# EAGLE schematic Drinks_MotorDriver (EAGLE 6.4)
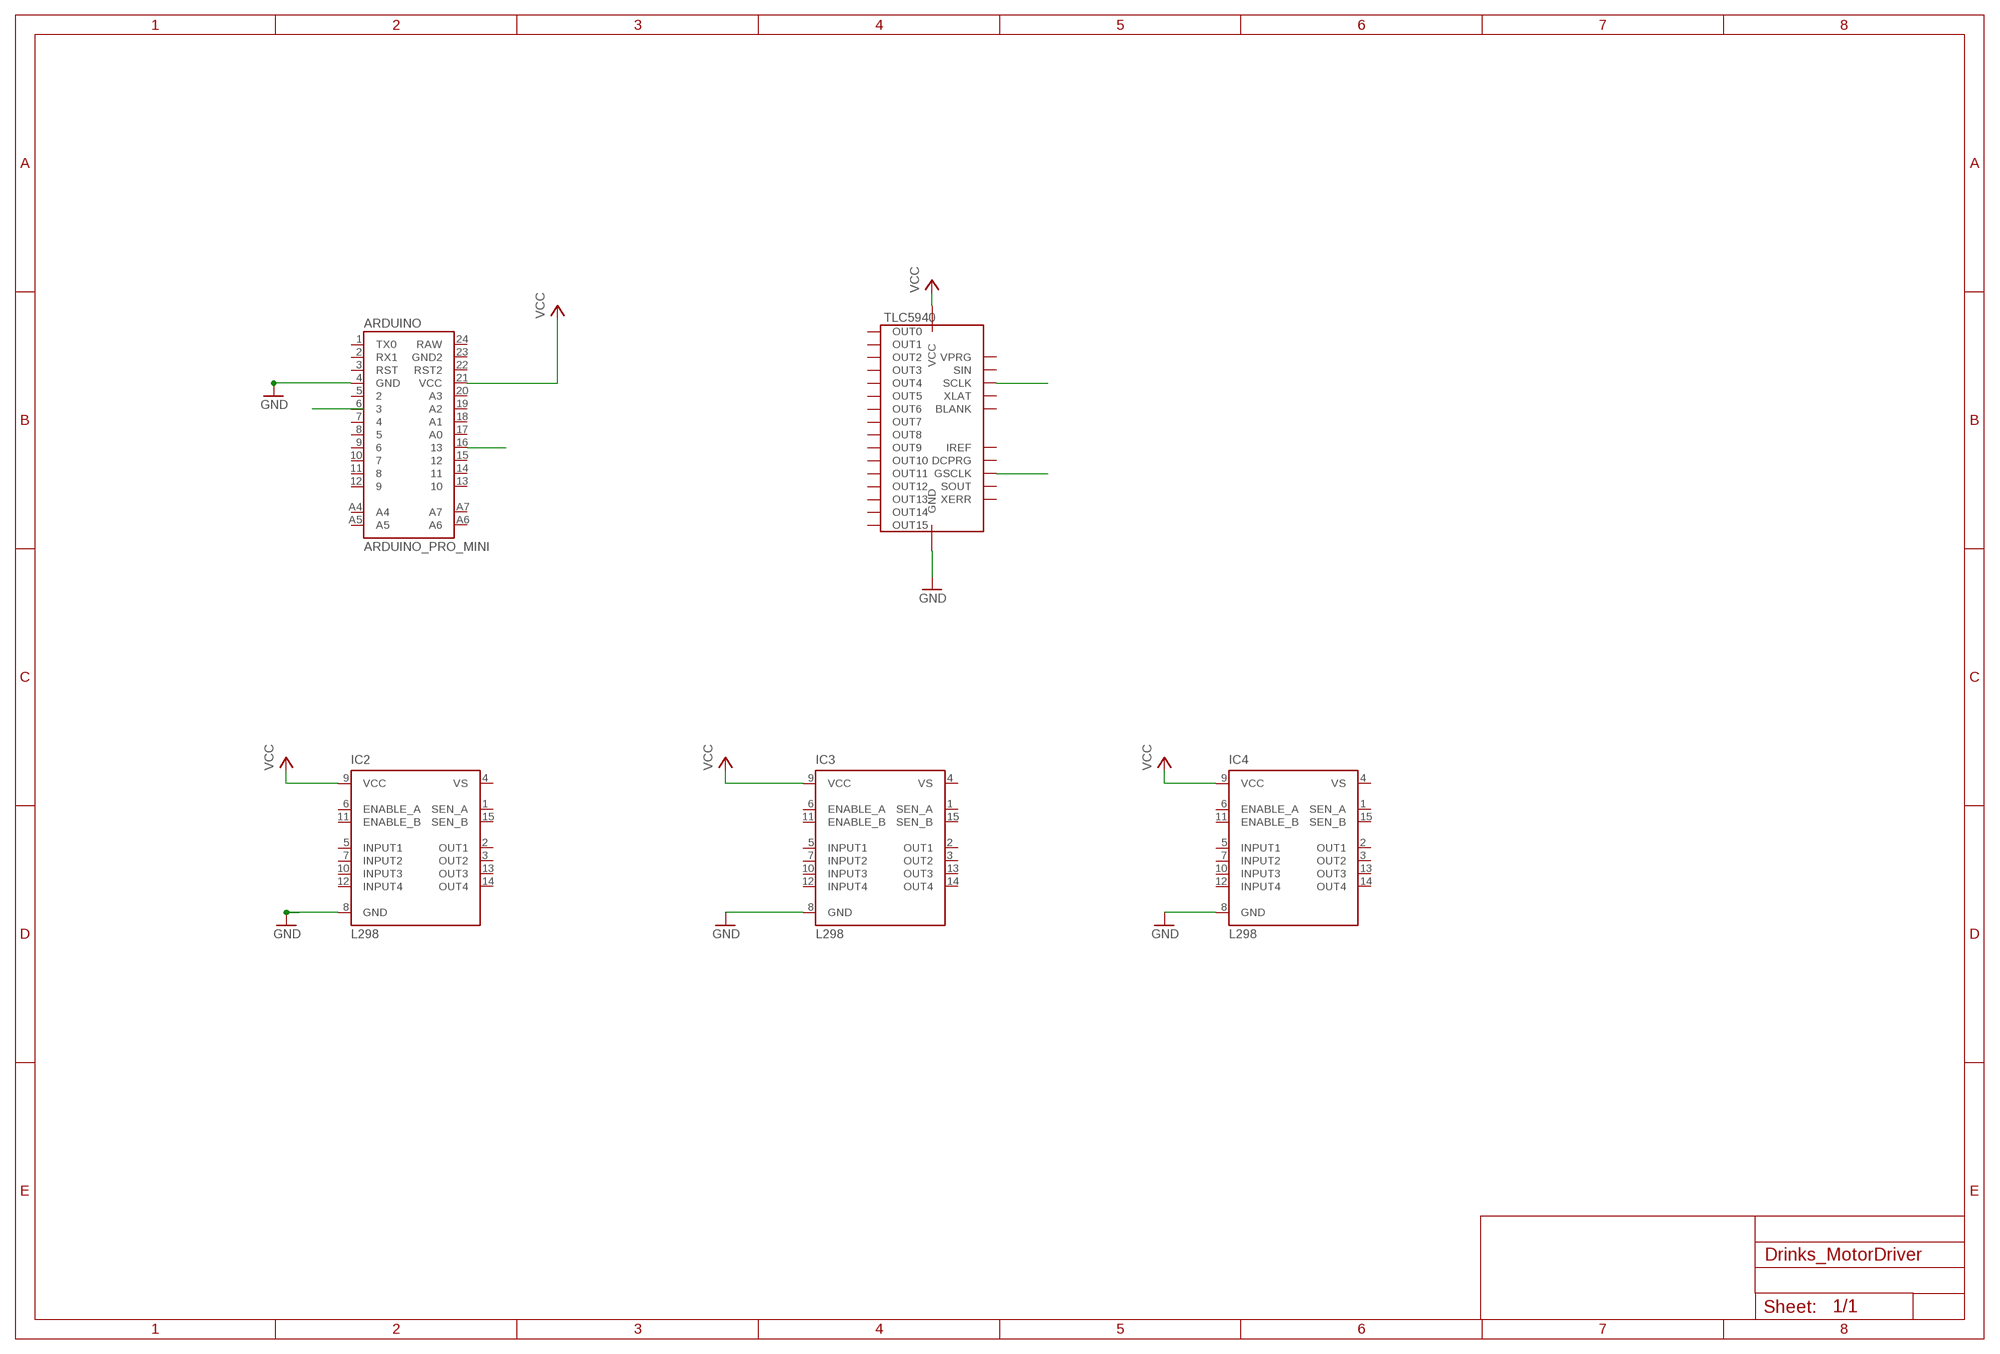
[diagram p0: schematic, sheet 1]

## Parts
ARDUINO  ARDUINO_PRO_MINI  [ARDUINO_PRO_MINI]
IC2  L298  [MULTIWATT-15]
IC3  L298  [MULTIWATT-15]
IC4  L298  [MULTIWATT-15]
TLC5940  IC-PACKAGE_DIL28-4  [IC-PACKAGE_DIL28-4]

## Nets
GND: ARDUINO.4(GND) IC2.8(GND) IC3.8(GND) IC4.8(GND) TLC5940.22(GND)
GSCLK: TLC5940.18(GSCLK)
SCLK: ARDUINO.16 TLC5940.25(SCLK)
VCC: ARDUINO.21(VCC) IC2.9(VCC) IC3.9(VCC) IC4.9(VCC) TLC5940.21(VCC)
Unconnected: ARDUINO.1(TX0) ARDUINO.2(RX1) ARDUINO.3(RST) ARDUINO.5 ARDUINO.6 ARDUINO.7 ARDUINO.8 ARDUINO.9 ARDUINO.10 ARDUINO.11 ARDUINO.12 ARDUINO.13 ARDUINO.14 ARDUINO.15 ARDUINO.17(A0) ARDUINO.18(A1) ARDUINO.19(A2) ARDUINO.20(A3) ARDUINO.22(RST2) ARDUINO.23(GND2) ARDUINO.24(RAW) ARDUINO.A4 ARDUINO.A5 ARDUINO.A6 ARDUINO.A7 IC2.1(SEN_A) IC2.2(OUT1) IC2.3(OUT2) IC2.5(INPUT1) IC2.6(ENABLE_A) IC2.7(INPUT2) IC2.10(INPUT3) IC2.11(ENABLE_B) IC2.12(INPUT4) IC2.13(OUT3) IC2.14(OUT4) IC2.15(SEN_B) IC3.1(SEN_A) IC3.2(OUT1) IC3.3(OUT2) IC3.5(INPUT1) IC3.6(ENABLE_A) IC3.7(INPUT2) IC3.10(INPUT3) IC3.11(ENABLE_B) IC3.12(INPUT4) IC3.13(OUT3) IC3.14(OUT4) IC3.15(SEN_B) IC4.1(SEN_A) IC4.2(OUT1) IC4.3(OUT2) IC4.5(INPUT1) IC4.6(ENABLE_A) IC4.7(INPUT2) IC4.10(INPUT3) IC4.11(ENABLE_B) IC4.12(INPUT4) IC4.13(OUT3) IC4.14(OUT4) IC4.15(SEN_B) TLC5940.1(OUT1) TLC5940.2(OUT2) TLC5940.3(OUT3) TLC5940.4(OUT4) TLC5940.5(OUT5) TLC5940.6(OUT6) TLC5940.7(OUT7) TLC5940.8(OUT8) TLC5940.9(OUT9) TLC5940.10(OUT10) TLC5940.11(OUT11) TLC5940.12(OUT12) TLC5940.13(OUT13) TLC5940.14(OUT14) TLC5940.15(OUT15) TLC5940.16(XERR) TLC5940.17(SOUT) TLC5940.19(DCPRG) TLC5940.20(IREF) TLC5940.23(BLANK) TLC5940.24(XLAT) TLC5940.26(SIN) TLC5940.27(VPRG) TLC5940.28(OUT0)

## Power pins joined to a net without a drawn wire
VS: IC2.4(VS) IC3.4(VS) IC4.4(VS)

## Library data of the parts
ARDUINO = SparkFun-Boards:ARDUINO_PRO_MINI
IC2-IC4 = st-microelectronics:L298: DUAL FULL-BRIDGE DRIVER; MPN: L298N; OC_FARNELL: 1589425; OC_NEWARK: 32M1527
TLC5940 = TLC5940:IC-PACKAGE_DIL28: Dual In Line